# EAGLE design KOTLETA (EAGLE 9.3.0)
Assembly variants: basic

## Sheet 1 of 2: page1
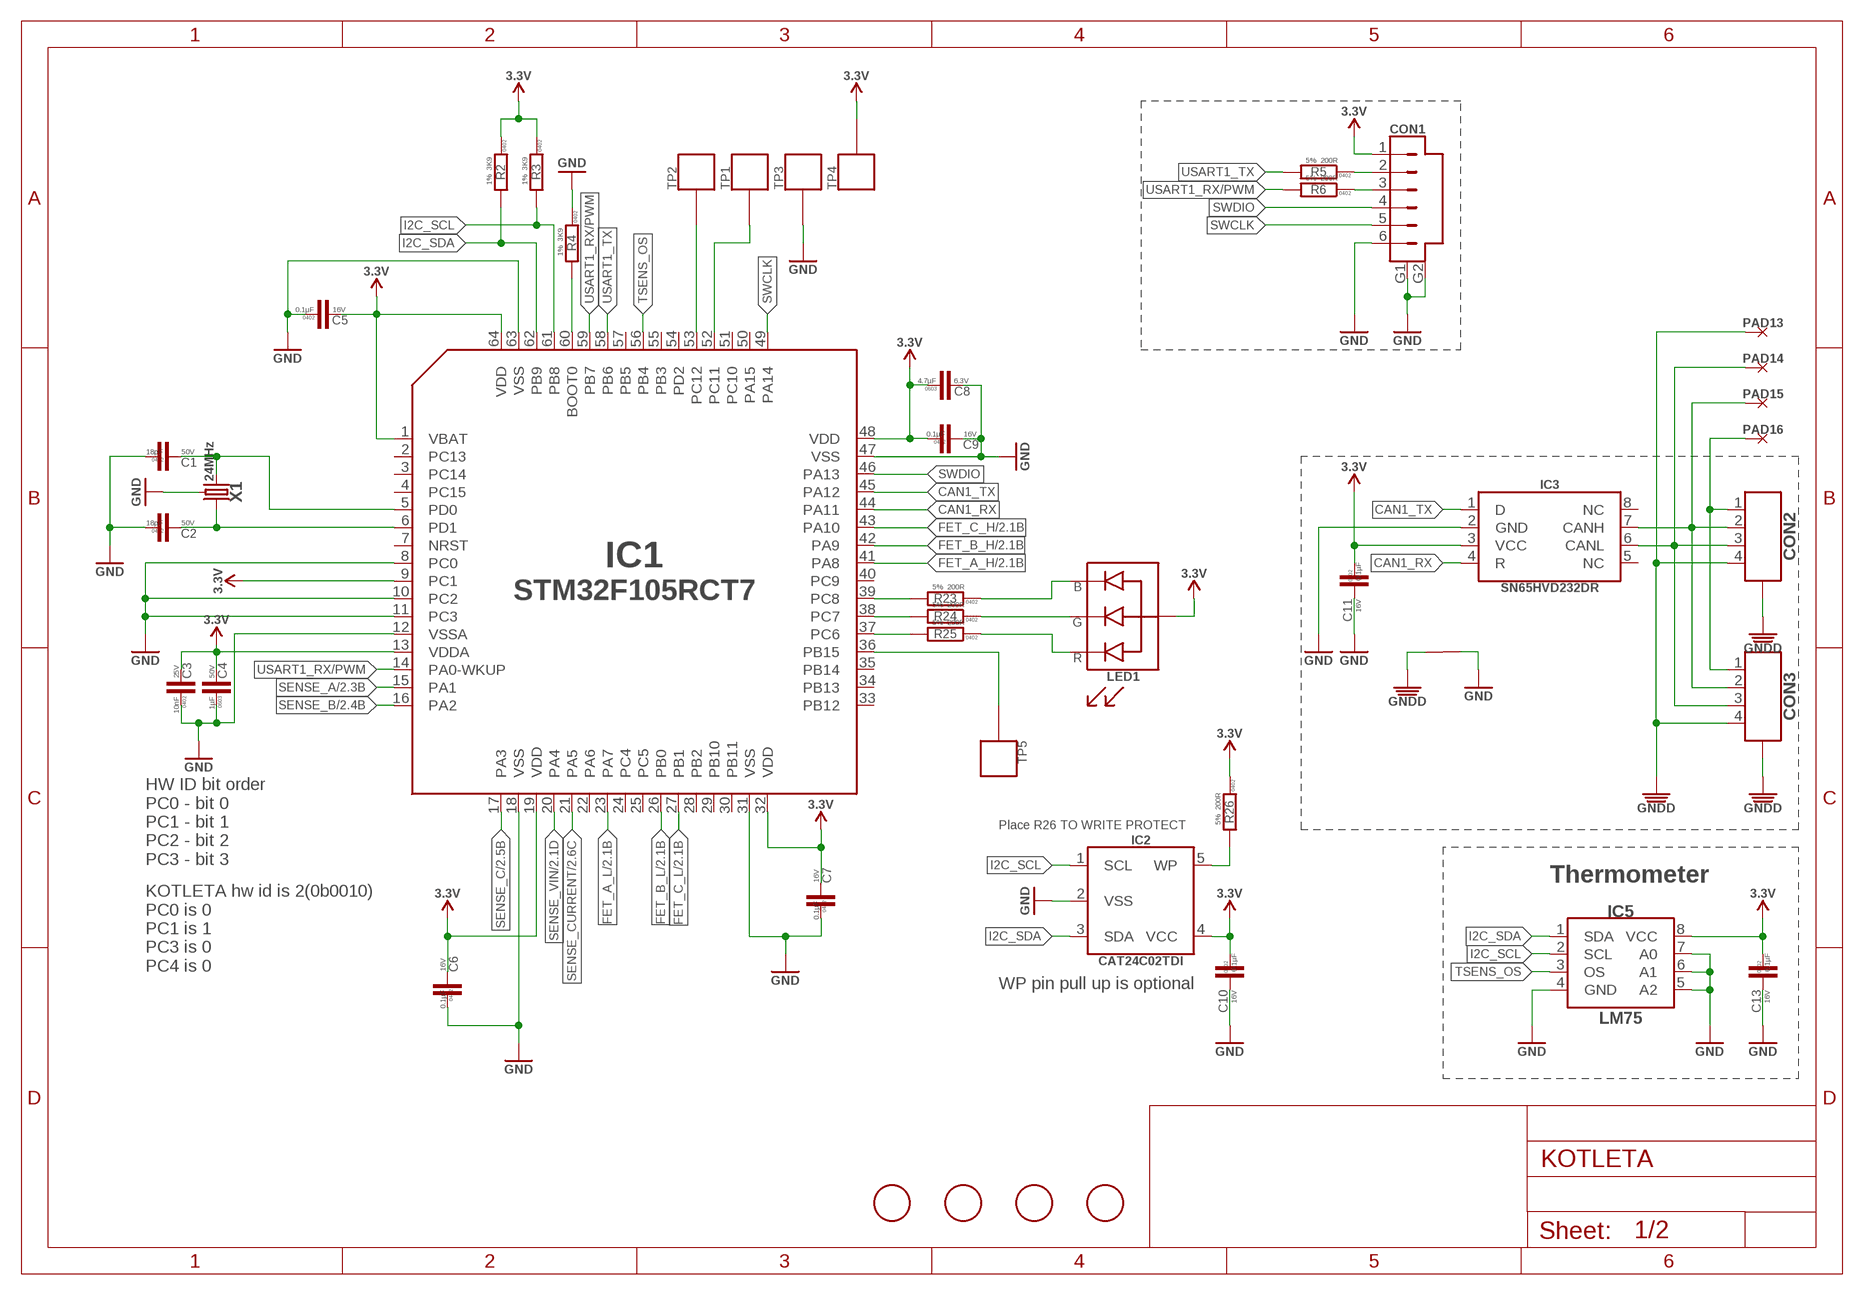
[diagram p0: schematic, sheet 1]

### Parts
C1  18pF  18PF-50V_5%_NP0-0402  [C0402]
C2  18pF  18PF-50V_5%_NP0-0402  [C0402]
C3  10nF  10NF-25V_10%_X7R-0402  [C0402]
C4  1µF  1µF-50V_10%_X7R-0603  [C0603]
C5  0.1µF  0.1µF-16V_10%_X7R-0402  [C0402]
C6  0.1µF  0.1µF-16V_10%_X7R-0402  [C0402]
C7  0.1µF  0.1µF-16V_10%_X7R-0402  [C0402]
C8  4.7µF  4.7µF-6.3V_10%_X7R-0603  [C0603]
C9  0.1µF  0.1µF-16V_10%_X7R-0402  [C0402]
C10  0.1µF  0.1µF-16V_10%_X7R-0402  [C0402]
C11  0.1µF  0.1µF-16V_10%_X7R-0402  [C0402]
C13  0.1µF  0.1µF-16V_10%_X7R-0402  [C0402]
CON1  CON-6P  [SM06B]
CON2  CON-4P-JST_GH-RA  [JST_GH-4P-RA]
CON3  CON-4P-JST_GH-RA  [JST_GH-4P-RA]
FD1  FIDUCIALMOUNT  [FIDUCIA-MOUNT]  (not fitted in variant basic)
FD2  FIDUCIALMOUNT  [FIDUCIA-MOUNT]  (not fitted in variant basic)
FD3  FIDUCIALMOUNT  [FIDUCIA-MOUNT]  (not fitted in variant basic)
FD4  FIDUCIALMOUNT  [FIDUCIA-MOUNT]  (not fitted in variant basic)
IC1  STM32F105RCT6  [TQFP64]
IC2  CAT24C02  [SOT23-5L]
IC3  SN65HVD232D  [SOIC8]
IC5  LM75BD-TSSOP8  [TSSOP8]
LED1  LTST-C19HE1WT  [LITE_ON_RGB_LED]
PAD13  PAD-HOLE-0.6  [HOLE_0.6]  (not fitted in variant basic)
PAD14  PAD-HOLE-0.6  [HOLE_0.6]  (not fitted in variant basic)
PAD15  PAD-HOLE-0.6  [HOLE_0.6]  (not fitted in variant basic)
PAD16  PAD-HOLE-0.6  [HOLE_0.6]  (not fitted in variant basic)
R2  3K9  3K9-1%-0402  [R0402]
R3  3K9  3K9-1%-0402  [R0402]
R4  3K9  3K9-1%-0402  [R0402]
R5  200R  200R-5%-0402  [R0402]
R6  200R  200R-5%-0402  [R0402]
R23  200R  200R-5%-0402  [R0402]
R24  200R  200R-5%-0402  [R0402]
R25  200R  200R-5%-0402  [R0402]
R26  200R  200R-5%-0402  [R0402]  (not fitted in variant basic)
TP1  PAD.05  [PAD.05X.05]  (not fitted in variant basic)
TP2  PAD.05  [PAD.05X.05]  (not fitted in variant basic)
TP3  PAD.05  [PAD.05X.05]  (not fitted in variant basic)
TP4  PAD.05  [PAD.05X.05]  (not fitted in variant basic)
TP5  PAD.05  [PAD.05X.05]  (not fitted in variant basic)
U$2  CONNECTION  [CONNECTION]  (not fitted in variant basic)
X1  24MHz  CRYSTAL-4P-24MHZ-3.2X2.5-4P  [OSCILLATOR-3.2X2.5-4P]

### Nets
BOOT0: IC1.60(BOOT0) R4.2
CAN1_RX: IC1.44(PA11) IC3.4(R)
CAN1_TX: IC1.45(PA12) IC3.1(D)
FET_A_H: IC1.41(PA8) ; also sheet 2
FET_A_L: IC1.23(PA7) ; also sheet 2
FET_B_H: IC1.42(PA9) ; also sheet 2
FET_B_L: IC1.26(PB0) ; also sheet 2
FET_C_H: IC1.43(PA10) ; also sheet 2
FET_C_L: IC1.27(PB1) ; also sheet 2
GND: C1.1 C2.1 C3.1 C4.P$1 C5.1 C6.1 C7.1 C8.P$2 C9.2 C10.2 C11.2 C13.2 CON1.6 CON1.G1 CON1.G2 IC1.8(PC0) IC1.10(PC2) IC1.11(PC3) IC1.12(VSSA) IC1.18(VSS) IC1.31(VSS) IC1.47(VSS) IC1.63(VSS) IC2.2(VSS) IC3.2(GND) IC5.4(GND) IC5.5(A2) IC5.6(A1) IC5.7(A0) R4.1 TP3.P$1 U$2.P$2 X1.2(GND) X1.4(GND) ; also sheet 2
GNDD: CON2.4 CON2.M$0(GND) CON2.M$1(GND) CON3.4 CON3.M$0(GND) CON3.M$1(GND) PAD13.P$1 U$2.P$1
I2C_SCL: IC1.61(PB8) IC2.1(SCL) IC5.2(SCL) R3.2
I2C_SDA: IC1.62(PB9) IC2.3(SDA) IC5.1(SDA) R2.2
N$1: CON1.2 R5.1
N$2: CON1.3 R6.1
N$3: IC1.37(PC6) R25.2
N$6: LED1.B R23.1
N$7: LED1.R R25.1
N$10: IC2.5(WP) R26.2
N$12: IC1.38(PC7) R24.2
N$16: C1.2 IC1.5(PD0) X1.3
N$18: IC1.39(PC8) R23.2
N$21: C2.2 IC1.6(PD1) X1.1
N$22: CON2.1 CON3.1 PAD16.P$1
N$23: CON2.2 CON3.2 IC3.7(CANH) PAD15.P$1
N$25: CON2.3 CON3.3 IC3.6(CANL) PAD14.P$1
N$26: LED1.G R24.1
N$27: IC1.53(PC12) TP2.P$1
N$28: IC1.36(PB15) TP5.P$1
N$29: IC1.52(PC11) TP1.P$1
SENSE_A: IC1.15(PA1) ; also sheet 2
SENSE_B: IC1.16(PA2) ; also sheet 2
SENSE_C: IC1.17(PA3) ; also sheet 2
SENSE_CURRENT: IC1.21(PA5) ; also sheet 2
SENSE_VIN: IC1.20(PA4) ; also sheet 2
SWCLK: CON1.5 IC1.49(PA14)
SWDIO: CON1.4 IC1.46(PA13)
TSENS_OS: IC1.56(PB4) IC5.3(OS)
USART1_RX/PWM: IC1.14(PA0-WKUP) IC1.59(PB7) R6.2
USART1_TX: IC1.58(PB6) R5.2
VDD_3V3: C3.2 C4.P$2 C5.2 C6.2 C7.2 C8.P$1 C9.1 C10.1 C11.1 C13.1 CON1.1 IC1.1(VBAT) IC1.9(PC1) IC1.13(VDDA) IC1.19(VDD) IC1.32(VDD) IC1.48(VDD) IC1.64(VDD) IC2.4(VCC) IC3.3(VCC) IC5.8(VCC) LED1.+(A) R2.1 R3.1 R26.1 TP4.P$1 ; supply symbol labelled 3.3V ; also sheet 2
Unconnected: IC1.2(PC13) IC1.3(PC14) IC1.4(PC15) IC1.7(NRST) IC1.22(PA6) IC1.24(PC4) IC1.25(PC5) IC1.28(PB2) IC1.29(PB10) IC1.30(PB11) IC1.33(PB12) IC1.34(PB13) IC1.35(PB14) IC1.40(PC9) IC1.50(PA15) IC1.51(PC10) IC1.54(PD2) IC1.55(PB3) IC1.57(PB5) IC3.5(NC) IC3.8(NC)

### Notes on the sheet
- Place R26 TO WRITE PROTECT
- HW ID bit order
  PC0 - bit 0
  PC1 - bit 1
  PC2 - bit 2
  PC3 - bit 3
- Thermometer
- KOTLETA hw id is 2(0b0010)
  PC0 is 0
  PC1 is 1
  PC3 is 0
  PC4 is 0
- WP pin pull up is optional

## Sheet 2 of 2
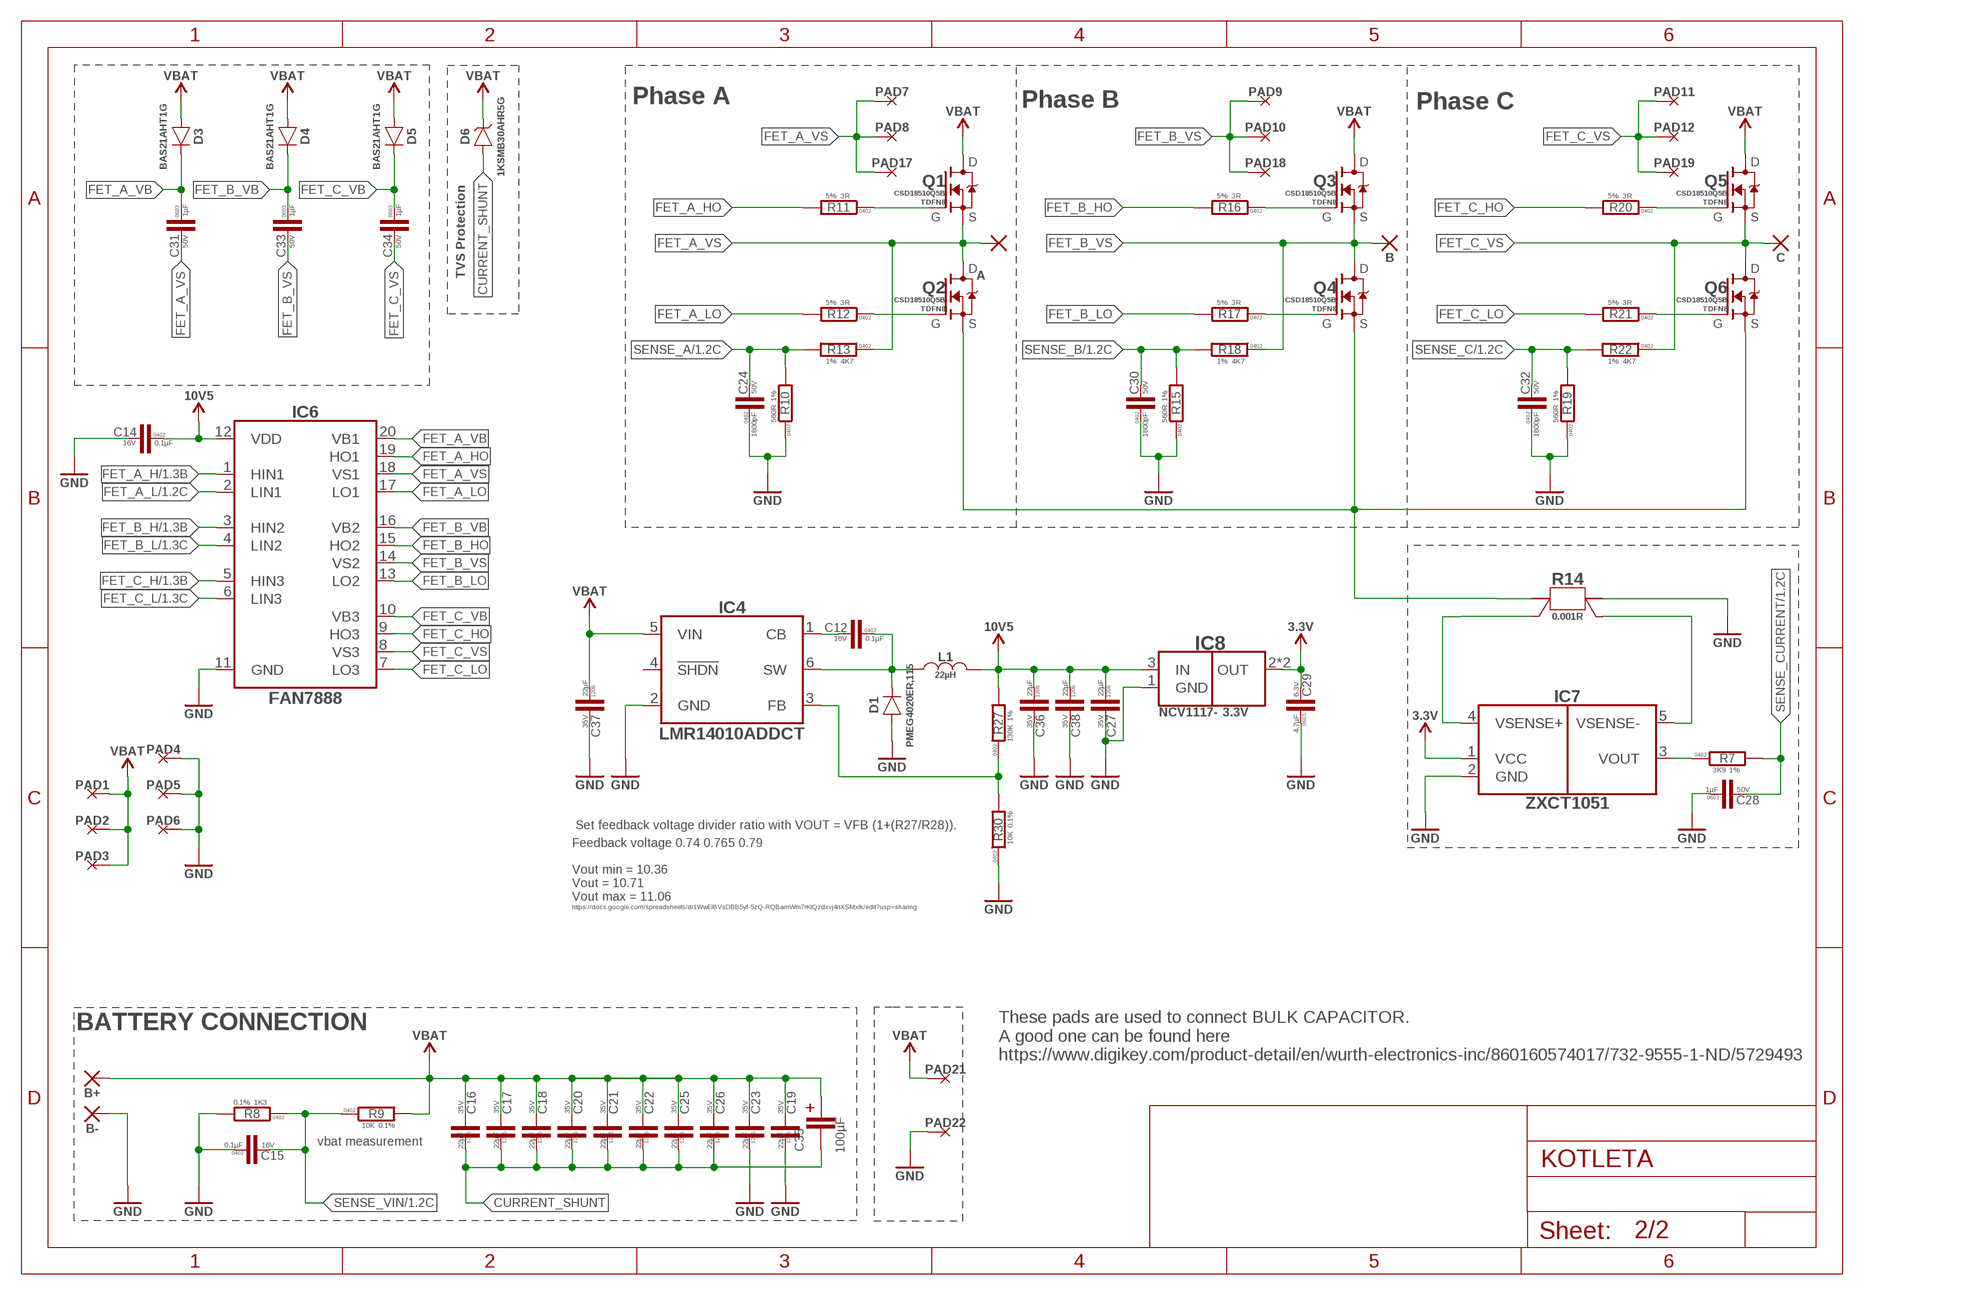
[diagram p1: schematic, sheet 2]

### Parts
A  WIREPADSMD5-2,5  [5-2,5]  (not fitted in variant basic)
B  WIREPADSMD5-2,5  [5-2,5]  (not fitted in variant basic)
B+  WIREPADSMD5-2,5  [5-2,5]  (not fitted in variant basic)
B-  WIREPADSMD5-2,5  [5-2,5]  (not fitted in variant basic)
C  WIREPADSMD5-2,5  [5-2,5]  (not fitted in variant basic)
C12  0.1µF  0.1µF-16V_10%_X7R-0402  [C0402]
C14  0.1µF  0.1µF-16V_10%_X7R-0402  [C0402]
C15  0.1µF  0.1µF-16V_10%_X7R-0402  [C0402]
C16  22µF  22µF-35V_20%_X5R-1206  [C1206]
C17  22µF  22µF-35V_20%_X5R-1206  [C1206]
C18  22µF  22µF-35V_20%_X5R-1206  [C1206]
C19  22µF  22µF-35V_20%_X5R-1206  [C1206]
C20  22µF  22µF-35V_20%_X5R-1206  [C1206]
C21  22µF  22µF-35V_20%_X5R-1206  [C1206]
C22  22µF  22µF-35V_20%_X5R-1206  [C1206]
C23  22µF  22µF-35V_20%_X5R-1206  [C1206]
C24  1800pF  1800PF-50V_10%_X7R-0402  [C0402]
C25  22µF  22µF-35V_20%_X5R-1206  [C1206]
C26  22µF  22µF-35V_20%_X5R-1206  [C1206]
C27  22µF  22µF-35V_20%_X5R-1206  [C1206]
C28  1µF  1µF-50V_10%_X7R-0603  [C0603]
C29  4.7µF  4.7µF-6.3V_10%_X7R-0603  [C0603]
C30  1800pF  1800PF-50V_10%_X7R-0402  [C0402]
C31  1µF  1µF-50V_10%_X7R-0603  [C0603]
C32  1800pF  1800PF-50V_10%_X7R-0402  [C0402]
C33  1µF  1µF-50V_10%_X7R-0603  [C0603]
C34  1µF  1µF-50V_10%_X7R-0603  [C0603]
C35  100µF  C-TANT-3024  [3024]
C36  22µF  22µF-35V_20%_X5R-1206  [C1206]
C37  22µF  22µF-35V_20%_X5R-1206  [C1206]
C38  22µF  22µF-35V_20%_X5R-1206  [C1206]
D1  PMEG4020  [SOD123W]
D3  BAS21AHT1G  [SOD323]
D4  BAS21AHT1G  [SOD323]
D5  BAS21AHT1G  [SOD323]
D6  1KSMB30AHR5G  [DO-214AA(SMB)]
IC4  LMR14010ADDCT  [SOT23-6]
IC6  FAN7888  [SOIC20]
IC7  ZXCT1051  [SOT23-5L]
IC8  3.3V  NCV1117-3.3  [SOT-223]
L1  22µH  22µH-22U-SRN5040  [SRN5040]
PAD1  PAD-HOLE-0.6  [HOLE_0.6]  (not fitted in variant basic)
PAD2  PAD-HOLE-0.6  [HOLE_0.6]  (not fitted in variant basic)
PAD3  PAD-HOLE-0.6  [HOLE_0.6]  (not fitted in variant basic)
PAD4  PAD-HOLE-0.6  [HOLE_0.6]  (not fitted in variant basic)
PAD5  PAD-HOLE-0.6  [HOLE_0.6]  (not fitted in variant basic)
PAD6  PAD-HOLE-0.6  [HOLE_0.6]  (not fitted in variant basic)
PAD7  PAD-HOLE-0.6  [HOLE_0.6]  (not fitted in variant basic)
PAD8  PAD-HOLE-0.6  [HOLE_0.6]  (not fitted in variant basic)
PAD9  PAD-HOLE-0.6  [HOLE_0.6]  (not fitted in variant basic)
PAD10  PAD-HOLE-0.6  [HOLE_0.6]  (not fitted in variant basic)
PAD11  PAD-HOLE-0.6  [HOLE_0.6]  (not fitted in variant basic)
PAD12  PAD-HOLE-0.6  [HOLE_0.6]  (not fitted in variant basic)
PAD17  PAD-HOLE-0.6  [HOLE_0.6]  (not fitted in variant basic)
PAD18  PAD-HOLE-0.6  [HOLE_0.6]  (not fitted in variant basic)
PAD19  PAD-HOLE-0.6  [HOLE_0.6]  (not fitted in variant basic)
PAD21  PAD-HOLE-0.8  [HOLE_0.8]
PAD22  PAD-HOLE-0.8  [HOLE_0.8]
Q1  CSD18510Q5B  [PG-TDSON-8]
Q2  CSD18510Q5B  [PG-TDSON-8]
Q3  CSD18510Q5B  [PG-TDSON-8]
Q4  CSD18510Q5B  [PG-TDSON-8]
Q5  CSD18510Q5B  [PG-TDSON-8]
Q6  CSD18510Q5B  [PG-TDSON-8]
R7  3K9  3K9-1%-0402  [R0402]
R8  1K3  1K3-0.1%-0402  [R0402]
R9  10K  10K-0.1%-0402  [R0402]
R10  560R  560R-1%-0402  [R0402]
R11  3R  3R-5%-0402  [R0402]
R12  3R  3R-5%-0402  [R0402]
R13  4K7  4K7-1%-0402  [R0402]
R14  0.001R  CURRENT_SHUNT_KELVIN-0.001R-2010-KELVIN  [R2010-KELVIN]
R15  560R  560R-1%-0402  [R0402]
R16  3R  3R-5%-0402  [R0402]
R17  3R  3R-5%-0402  [R0402]
R18  4K7  4K7-1%-0402  [R0402]
R19  560R  560R-1%-0402  [R0402]
R20  3R  3R-5%-0402  [R0402]
R21  3R  3R-5%-0402  [R0402]
R22  4K7  4K7-1%-0402  [R0402]
R27  130K  R-1%-0402  [R0402]
R30  10K  10K-0.1%-0402  [R0402]

### Nets
BLABLA: IC7.3(VOUT) R7.1
CURRENT_SHUNT: C16.P$1 C17.P$1 C18.P$1 C20.P$1 C21.P$1 C22.P$1 C25.P$1 C26.P$1 C35.- D6.A Q2.1S(S) Q2.2S(S) Q2.3S(S) Q4.1S(S) Q4.2S(S) Q4.3S(S) Q6.1S(S) Q6.2S(S) Q6.3S(S) R14.1 R14.11
FET_A_H: IC6.1(HIN1) ; also sheet 1
FET_A_HO: IC6.19(HO1) R11.2
FET_A_L: IC6.2(LIN1) ; also sheet 1
FET_A_LO: IC6.17(LO1) R12.2
FET_A_VB: C31.P$1 D3.C IC6.20(VB1)
FET_A_VS: A.1(P) C31.P$2 IC6.18(VS1) PAD7.P$1 PAD8.P$1 PAD17.P$1 Q1.1S(S) Q1.2S(S) Q1.3S(S) Q2.5D(D) Q2.6D(D) Q2.7D(D) Q2.8D(D) Q2.PAD_D(D) R13.1
FET_B_H: IC6.3(HIN2) ; also sheet 1
FET_B_HO: IC6.15(HO2) R16.2
FET_B_L: IC6.4(LIN2) ; also sheet 1
FET_B_LO: IC6.13(LO2) R17.2
FET_B_VB: C33.P$1 D4.C IC6.16(VB2)
FET_B_VS: B.1(P) C33.P$2 IC6.14(VS2) PAD9.P$1 PAD10.P$1 PAD18.P$1 Q3.1S(S) Q3.2S(S) Q3.3S(S) Q4.5D(D) Q4.6D(D) Q4.7D(D) Q4.8D(D) Q4.PAD_D(D) R18.1
FET_C_H: IC6.5(HIN3) ; also sheet 1
FET_C_HO: IC6.9(HO3) R20.2
FET_C_L: IC6.6(LIN3) ; also sheet 1
FET_C_LO: IC6.7(LO3) R21.2
FET_C_VB: C34.P$1 D5.C IC6.10(VB3)
FET_C_VS: C34.P$2 C.1(P) IC6.8(VS3) PAD11.P$1 PAD12.P$1 PAD19.P$1 Q5.1S(S) Q5.2S(S) Q5.3S(S) Q6.5D(D) Q6.6D(D) Q6.7D(D) Q6.8D(D) Q6.PAD_D(D) R22.1
GND: B-.1(P) C14.2 C15.1 C19.P$1 C23.P$1 C24.1 C27.P$2 C28.P$1 C29.P$1 C30.1 C32.1 C36.P$2 C37.P$2 C38.P$2 D1.A IC4.2(GND) IC6.11(GND) IC7.2(GND) IC8.1(GND) PAD4.P$1 PAD5.P$1 PAD6.P$1 PAD22.P$1 R8.2 R10.1 R14.2 R14.22 R15.1 R19.1 R30.1 ; also sheet 1
N$4: Q2.4G(G) R12.1
N$5: Q3.4G(G) R16.1
N$8: Q4.4G(G) R17.1
N$11: Q5.4G(G) R20.1
N$13: IC7.5(VSENSE-) R14.S2
N$14: Q1.4G(G) R11.1
N$17: Q6.4G(G) R21.1
N$19: C12.1 D1.C IC4.6(SW) L1.P$1
N$20: IC7.4(VSENSE+) R14.S1
N$24: IC4.3(FB) R27.1 R30.2
N$31: C12.2 IC4.1(CB)
SENSE_A: C24.2 R10.2 R13.2 ; also sheet 1
SENSE_B: C30.2 R15.2 R18.2 ; also sheet 1
SENSE_C: C32.2 R19.2 R22.2 ; also sheet 1
SENSE_CURRENT: C28.P$2 R7.2 ; also sheet 1
SENSE_VIN: C15.2 R8.1 R9.1 ; also sheet 1
VBAT: B+.1(P) C16.P$2 C17.P$2 C18.P$2 C19.P$2 C20.P$2 C21.P$2 C22.P$2 C23.P$2 C25.P$2 C26.P$2 C35.+ C37.P$1 D3.A D4.A D5.A D6.C IC4.5(VIN) PAD1.P$1 PAD2.P$1 PAD3.P$1 PAD21.P$1 Q1.5D(D) Q1.6D(D) Q1.7D(D) Q1.8D(D) Q1.PAD_D(D) Q3.5D(D) Q3.6D(D) Q3.7D(D) Q3.8D(D) Q3.PAD_D(D) Q5.5D(D) Q5.6D(D) Q5.7D(D) Q5.8D(D) Q5.PAD_D(D) R9.2
VDD_3V3: C29.P$2 IC7.1(VCC) IC8.2(OUT) IC8.4(OUT) ; supply symbol labelled 3.3V ; also sheet 1
VDD_10V5: C14.1 C27.P$1 C36.P$1 C38.P$1 IC6.12(VDD) IC8.3(IN) L1.P$2 R27.2 ; supply symbol labelled 10V5
Unconnected: IC4.4(!SHDN)

### Notes on the sheet
- Phase A | Phase B | Phase C
- TVS Protection
- Set feedback voltage divider ratio with VOUT = VFB (1+(R27/R28)).
- Feedback voltage 0.74 0.765 0.79
- Vout min = 10.36
  Vout = 10.71
  Vout max = 11.06
- https://docs.google.com/spreadsheets/d/1WwElBVsDBB5yf-5zQ-RQBamWm7rKtQzdxvj4nXSMxlk/edit?usp=sharing
- BATTERY CONNECTION
- These pads are used to connect BULK CAPACITOR.
  A good one can be found here
  https://www.digikey.com/product-detail/en/wurth-electronics-inc/860160574017/732-9555-1-ND/5729493
- vbat measurement

## Library data of the parts
A B B+ B- C = valenok_master_library:WIREPAD: Wire PAD connect wire on PCB
C1 C2 = C_digikey:18PF; DIGIKEY#: 399-8828-1-ND; MANF: Kemet; MANF#: CBR04C180F5GAC; OPERATING_TEMP: -55°C ~ 125°C; PACKAGE: 0402; TC: C0G, NP0; TOLERANCE: +-1%; VOLTAGE: 50V
C3 = C_digikey:10NF; DIGIKEY#: 490-1312-1-ND; MANF: Murata Electronics North America; MANF#: GRM155R71E103KA01D; OPERATING_TEMP: -55°C ~ 125°C; PACKAGE: 0402; TC: X7R; TOLERANCE: +-10%; VOLTAGE: 25V
C4 C28 C31 C33 C34 = C_digikey:1µF; DIGIKEY#: 587-3247-1-ND; MANF: Taiyo Yuden; MANF#: UMK107AB7105KA-T; OPERATING_TEMP: -55°C ~ 125°C; PACKAGE: 0603; TC: X7R; TOLERANCE: +-10%; VOLTAGE: 50V
C5-C7 C9-C15 = C_digikey:0.1µF; DIGIKEY#: 490-3261-1-ND; MANF: Murata Electronics North America; MANF#: GRM155R71C104KA88D; OPERATING_TEMP: -55°C ~ 125°C; PACKAGE: 0402; TC: X7R; TOLERANCE: +-10%; VOLTAGE: 16V
C8 C29 = C_digikey:4.7µF; DIGIKEY#: 1276-2087-1-ND; MANF: Samsung Electro-Mechanics America; MANF#: CL10B475KQ8NQNC; OPERATING_TEMP: -55°C ~ 125°C; PACKAGE: 0603; TC: X7R; TOLERANCE: +-10%; VOLTAGE: 6.3V
C16-C23 C25-C27 C36-C38 = C_digikey:22µF; DIGIKEY#: 445-8045-6-ND; MANF: TDK Corporation; MANF#: C3216X5R1V226M160AC; OPERATING_TEMP: -55°C ~ 85°C; PACKAGE: 1206; TC: X5R; TOLERANCE: +-20%; VOLTAGE: 35V
C24 C30 C32 = C_digikey:1800PF; DIGIKEY#: 311-1721-1-ND; MANF: Yageo; MANF#: CC0402KRX7R9BB182; OPERATING_TEMP: -55°C ~ 125°C; PACKAGE: 0402; TC: X7R; TOLERANCE: ±10%; VOLTAGE: 50V
C35 = sapog_reference_hardware:C-TANT: Tantalum capacitor; DIGIKEY#: 718-1942-1-ND; MANF: Vishay Sprague; MANF#: 597D107X0035F2T; OPERATING_TEMPERATURE: -55°C ~ 125°C; VOLTAGE: 35V
CON1 = Connectors:CON-6P: CONN HEADER SH 6POS SIDE 1MM TIN; DIGIKEY#: 455-1806-1-ND; MANF: JST Sales America Inc; MANF#: SM06B-SRSS-TB(LF)(SN); PARTNO: SM06B-SRSS-TB
CON2 CON3 = Connectors:CON-4P: Connector Receptacle 4 Position 0.049" (1.25mm) Tin Surface Mount; DIGIKEY#: 455-1566-1-ND; MANF: JST Sales America Inc; MANF#: SM04B-GHS-TB(LF)(SN)
D1 = Diodes:PMEG4020: DIODE SCHOTTKY 40V 2A SOD123W; DIGIKEY#: 1727-5385-2-ND; IF: 2A; MANF: NXP Semiconductors; MANF#: PMEG4020ER,115; VOLTAGE: 40V
D3-D5 = Diodes:BAS21AHT1G: Diode Standard 250V 200mA (DC) Surface Mount SOD-323; DIGIKEY#: BAS21AHT1GOSCT-ND; MANF: ON Semiconductor; MANF#: BAS21AHT1G
D6 = TVS_diodes:1KSMB30AHR5G: TVS DIODE 25.6V 41.4V DO214AA; DIGIKEY#: 1KSMB30AHR5GTR-ND; MANF: Taiwan Semiconductor Corporation; MANF#: 1KSMB30AHR5G
FD1-FD4 = sapog_reference_hardware:FIDUCIALMOUNT
IC1 = stm32:STM32F105RCT6: ARM® Cortex®-M3 STM32F1 Microcontroller IC 32-Bit 72MHz 256KB (256K x 8) FLASH; DIGIKEY#: 497-11547-ND; MANF: STMicroelectronics; MANF#: STM32F105RCT7; OPERATING_TEMP: -40°C ~ 105°C (TA)
IC2 = misc:CAT24C02: IC EEPROM 2KBIT 400KHZ TSOT23-5; DIGIKEY#: CAT24C02TDI-GT3AOSCT-ND; MANF: ON Semiconductor; MANF#: CAT24C02TDI-GT3A
IC3 = serial_interfaces:SN65HVD232D: IC CAN TRANSCEIVER 3.3V 8-SOIC; DIGIKEY#: 296-26344-1-ND; MANF: Texas Instruments; MANF#: SN65HVD232DR
IC4 = dc-dc:LMR14010ADDCT: Buck Switching Regulator IC Positive Adjustable 0.765V 1 Output 1A SOT-23-6 Thin, TSOT-23-6 Datasheet <http://www.ti.com/lit/ds/symlink/lmr14010a.pdf>; DIGIKEY#: 296-49072-2-ND; MANF: Texas Instruments; MANF#: LMR14010ADDCT
IC5 = misc:LM75BD: SENSOR TEMPERATURE I2C 8TSSOP; DIGIKEY#: 568-4768-1-ND; MANF: NXP Semiconductors; MANF#: LM75BDP,118
IC6 = mosfet_drivers:FAN7888: IC GATE DRIVER HALF BRIDG 20SOIC; DIGIKEY#: FAN7888MXTR-ND; MANF: Fairchild Semiconductor; MANF#: FAN7888MX; PARTNO: FAN7888MX
IC7 = misc:ZXCT1051: IC CURRENT MONITOR 1% SOT23-5; DIGIKEY#: ZXCT1051E5CT-ND; MANF: Diodes Incorporated; MANF#: ZXCT1051E5TA
IC8 = linear regulators:NCV1117-3.3: IC REG LDO 3.3V 1A SOT223; DIGIKEY#: NCV1117ST33T3GOSCT-ND; MANF: ON Semiconductor; MANF#: NCV1117ST33T3G
L1 = power_inductors:22µH: Wirewound Inductor; DIGIKEY#: SRN5040-220MCT-ND; MANF: Bourns Inc; MANF#: SRN5040-220M
LED1 = myxa_masterlib:LTST-C19HE1WT; DIGIKEY#: 160-2162-1-ND; MANF: Lite-On Inc; MANF#: LTST-C19HE1WT
PAD1-PAD19 PAD21 PAD22 = PADS:PAD
Q1-Q6 = mosfet:CSD18510Q5B: N-Channel 40V 300A (Tc) 156W (Tc) Surface Mount 8-VSON-CLIP (5x6); DIGIKEY#: 296-48514-2-ND; MANF: Texas Instruments; MANF#: CSD18510Q5B; PACKAGE: TDFN8
R2-R4 R7 = R_digikey:3K9; DIGIKEY#: 311-3.90KLRCT-ND; MANF: Yageo; MANF#: RC0402FR-073K9L; PACKAGE: 0402; TOLERANCE: 1%
R5 R6 R23-R26 = R_digikey:200R; DIGIKEY#: 311-200JRCT-ND; MANF: Yageo; MANF#: RC0402JR-07200RL; PACKAGE: 0402; PARTNO: RC0402FR-07240RL; TOLERANCE: 5%
R8 = R_digikey:1K3; DIGIKEY#: P1.3KDCCT-ND; MANF: Panasonic Electronic Components; MANF#: ERA-2AEB132X; PACKAGE: 0402; TOLERANCE: 0.1%
R9 R30 = R_digikey:10K; DIGIKEY#: P10KDCCT-ND; MANF: Panasonic Electronic Components; MANF#: ERA-2AEB103X; PACKAGE: 0402; TOLERANCE: 0.1%
R10 R15 R19 = R_digikey:560R; DIGIKEY#: 541-560LCT-ND; MANF: Vishay Dale; MANF#: CRCW0402560RFKED; PACKAGE: 0402; TOLERANCE: 1%
R11 R12 R16 R17 R20 R21 = R_digikey:3R; DIGIKEY#: P3.0JCT-ND; MANF: Panasonic Electronic Components; MANF#: ERJ-2GEJ3R0X; PACKAGE: 0402; TOLERANCE: 5%
R13 R18 R22 = R_digikey:4K7; DIGIKEY#: 311-4.7KLRCT-ND; MANF: Yageo; MANF#: RC0402FR-074K7L; PACKAGE: 0402; TOLERANCE: 1%
R14 = SHUNT_RESISTORS:CURRENT_SHUNT_KELVIN; DIGIKEY#: CSNL2010FT1L00TR-ND; MANF: Stackpole Electronics Inc.; MANF#: CSNL2010FT1L00; POWER: 1.5W; TC: ±50ppm/°C; TOLERANCE: 1%
R27 = rc:R; DIGIKEY#: YAG2969CT-ND; MANF: Yageo; MANF#: RC0402FR-07130KL; PACKAGE: 0402; TOLERANCE: 1%
TP1-TP5 = pixhawk2:PAD: Test pad This footprint includes three classes: The actual test pads, a pogo-pin footprint to mount the pogo-pin as through-hole part and a hole footprint which allows the head of the pogo-pin to pass through (do NOT use the hole to mount the pogo-pin). In a typical test setup, the stack would consist of three PCBs: The actual PCB under testing with a test pad on the bottom, then a second PCB with the hole for the pogo-pin head where the PCB under testing is pressed on and a third PCB at 30 mm / 1.2" distance with the pogo-pin footprints. The pogo-pins are soldered to the last PCB. To create the stack, copy the board under testing and exchange the footprints - this way the correct positioning is ensured.; BOM: EXCLUDE; PARTNO: *
U$2 = GNSS2_master_lib:CONNECTION; BOM: EXCLUDE
X1 = crystal:CRYSTAL-4P: Smd Crystal 18pF; DIGIKEY#: 1253-1198-1-ND; MANF: Kyocera International Inc. Electronic Components; MANF#: CX3225GB24000P0HPQCC

## Net classes
1 power: width 0.15 mm, drill 0.2 mm, clearance 0.152 mm

## Board
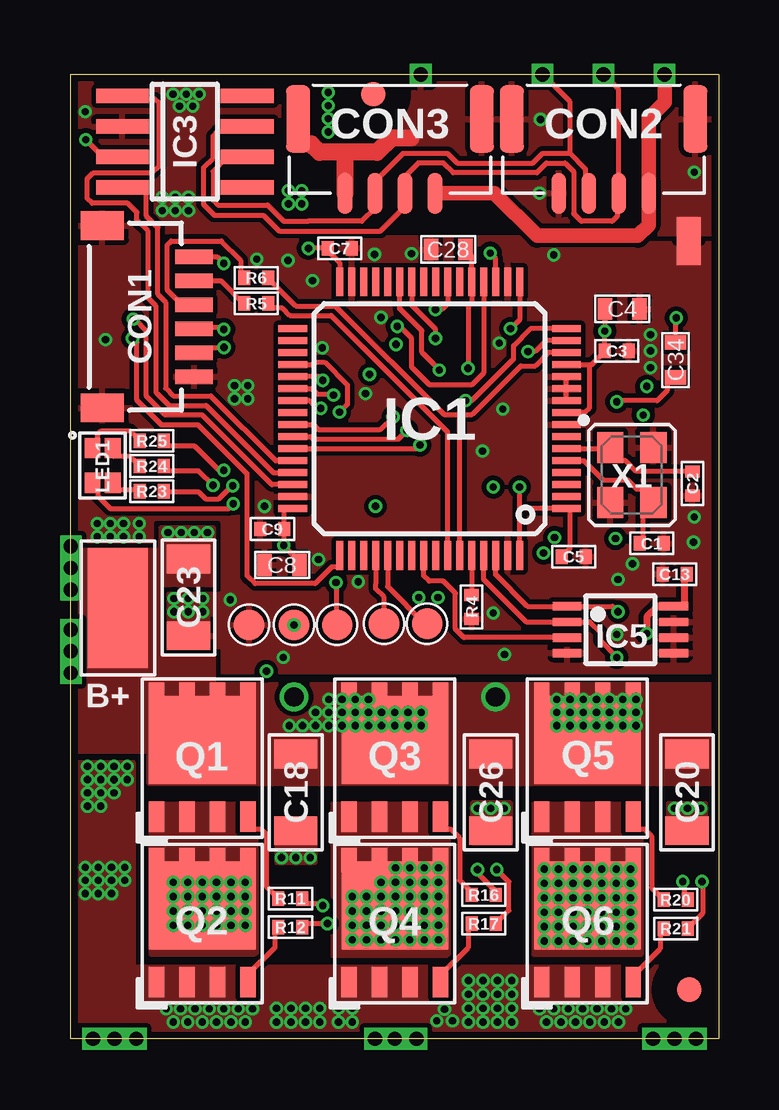
[diagram p2: board, top side]
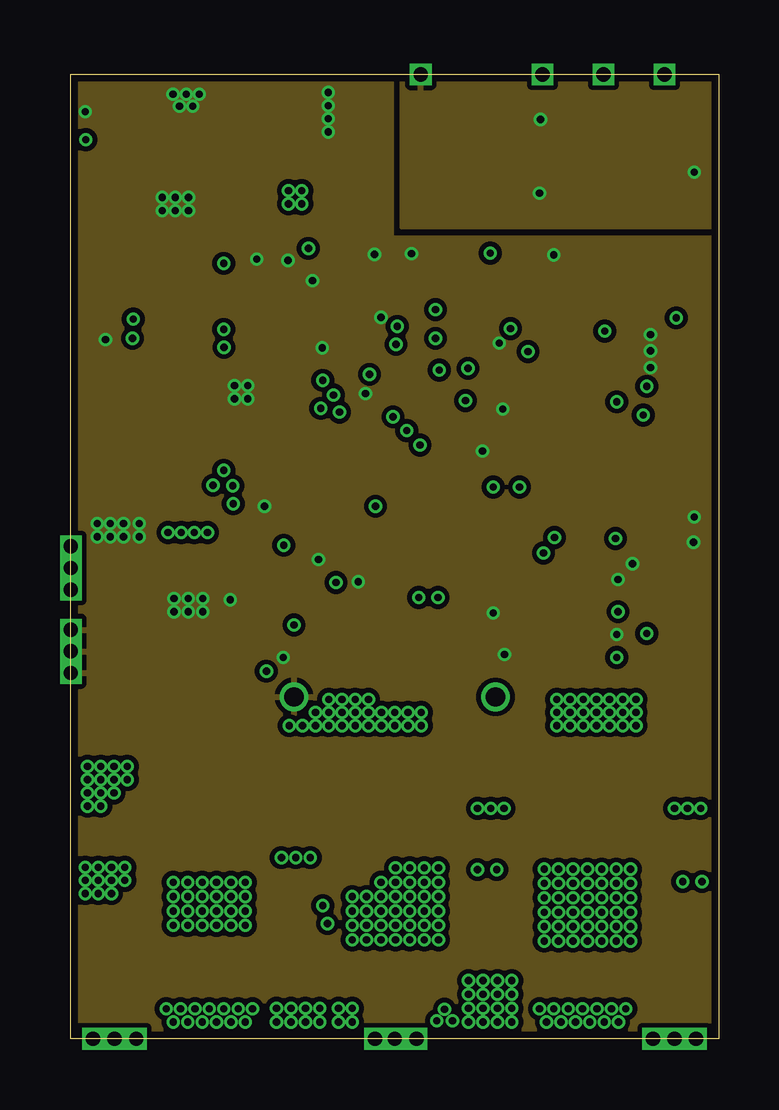
[diagram p3: board, inner layer gnd]
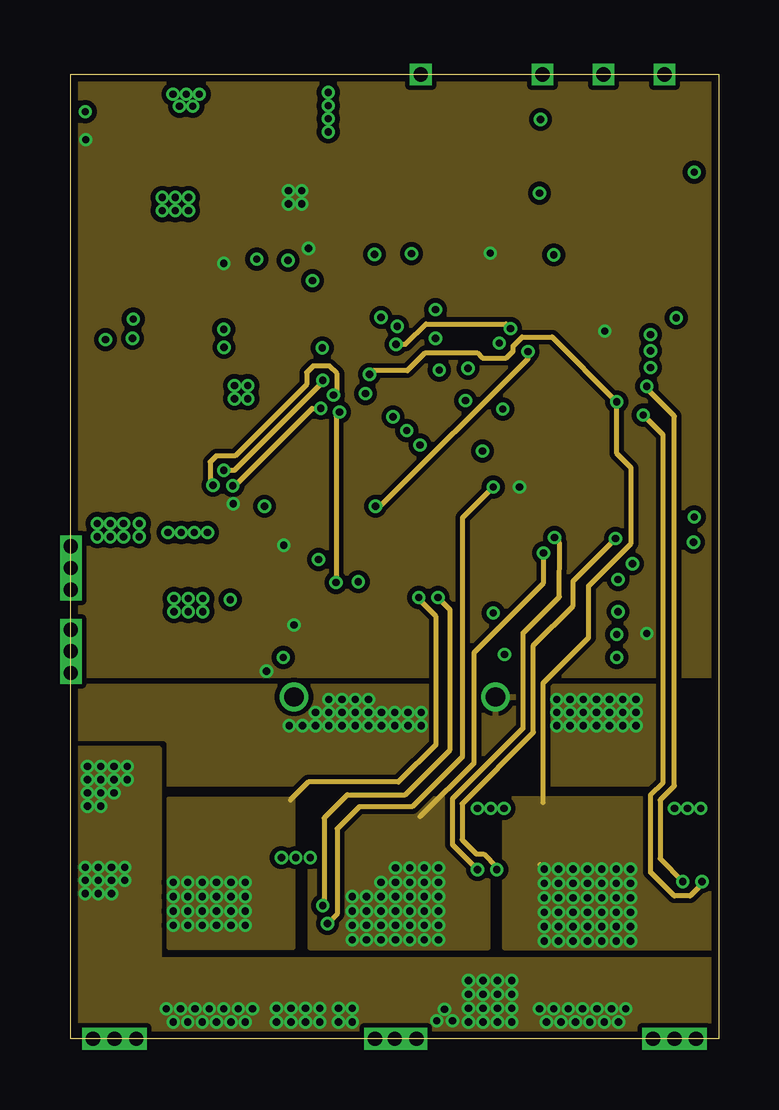
[diagram p4: board, inner layer SUPPLY]
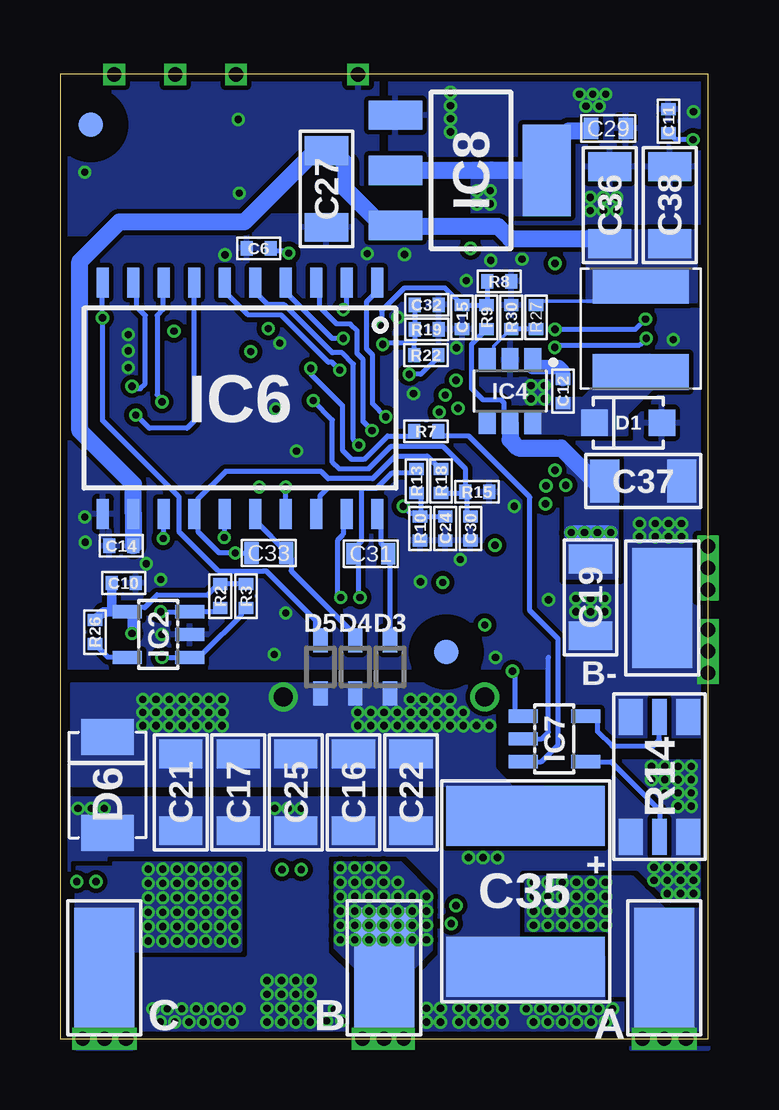
[diagram p5: board, bottom side, seen from below]

Size 27 x 40.2 mm. Coordinates in mm from the lower left corner, seen from the top.
Outline: 0,38.3 0,39.3
Outline: 0,39.3 0,40.2 25.93,40.2 27,40.2 27,38.55 27,0 18.75,0 0,0 0,39.3
Copper layers (1+2*3+16): Top 0.035mm / dielectric 0.012mm / gnd 0.035mm / dielectric 1.5mm / SUPPLY 0.035mm / dielectric 0.012mm / Bottom 0.035mm
Design rules "px_4layer_corrected *": minimum track width 6mil, minimum drill 0.2mm, track to track 0.2mm, track to pad 0.2mm, pad to pad 0.2mm, via to via 0.2mm, smd to smd 0.15mm, copper to edge 0.3mm, drill to drill 0.2mm, minimum pad ring 0.125mm, minimum via ring 0.125mm, stop-mask expansion 1mil, vias tented up to drill 0.31mm, thermal gap 8mil

### Footprints (pad centres in the part's own frame; a part is rotated, then mirrored left to right if it is on the bottom)
5-2,5 = smd 2.5 x 5: 1 0,0
C0402 = smd 0.5 x 0.6: 1 -0.5,0; 2 0.5,0
C0603 = smd 0.6 x 0.9: P$1 -0.725,0; P$2 0.725,0
C1206 = smd 1.2 x 1.8: P$1 -1.6,0; P$2 1.6,0
3024 = smd 2.5 x 6.6: + -3.15,0; - 3.15,0
SM06B = smd 0.6 x 1.55: 1 -2.5,2.275; 2 -1.5,2.275; 3 -0.5,2.275; 4 0.5,2.275; 5 1.5,2.275; 6 2.5,2.275 | smd 1.2 x 1.8: G1 -3.8,-1.55; G2 3.8,-1.55
JST_GH-4P-RA = smd 0.6 x 1.7: 1 1.875,-2.91; 2 0.625,-2.91; 3 -0.625,-2.91; 4 -1.875,-2.91 | smd 1 x 2.8: M$0 -3.825,0.19; M$1 3.825,0.19
SOD123W = smd 1.1 x 1.1: A -1.4,0; C 1.4,0
SOD323 = smd 1 x 0.6: A 1.1,0; C -1.1,0
DO-214AA(SMB) = smd 1.5 x 2.2: A -2,0; C 2,0
FIDUCIA-MOUNT = smd 1.016 x 1.016: P$1 0,0
TQFP64 = smd 1.2 x 0.3: 1 -5.7,3.75; 2 -5.7,3.25; 3 -5.7,2.75; 4 -5.7,2.25; 5 -5.7,1.75; 6 -5.7,1.25; 7 -5.7,0.75; 8 -5.7,0.25; 9 -5.7,-0.25; 10 -5.7,-0.75; 11 -5.7,-1.25; 12 -5.7,-1.75; 13 -5.7,-2.25; 14 -5.7,-2.75; 15 -5.7,-3.25; 16 -5.7,-3.75; 33 5.7,-3.75; 34 5.7,-3.25; 35 5.7,-2.75; 36 5.7,-2.25; 37 5.7,-1.75; 38 5.7,-1.25; 39 5.7,-0.75; 40 5.7,-0.25; 41 5.7,0.25; 42 5.7,0.75; 43 5.7,1.25; 44 5.7,1.75; 45 5.7,2.25; 46 5.7,2.75; 47 5.7,3.25; 48 5.7,3.75 | smd 0.3 x 1.2: 17 -3.75,-5.7; 18 -3.25,-5.7; 19 -2.75,-5.7; 20 -2.25,-5.7; 21 -1.75,-5.7; 22 -1.25,-5.7; 23 -0.75,-5.7; 24 -0.25,-5.7; 25 0.25,-5.7; 26 0.75,-5.7; 27 1.25,-5.7; 28 1.75,-5.7; 29 2.25,-5.7; 30 2.75,-5.7; 31 3.25,-5.7; 32 3.75,-5.7; 49 3.75,5.7; 50 3.25,5.7; 51 2.75,5.7; 52 2.25,5.7; 53 1.75,5.7; 54 1.25,5.7; 55 0.75,5.7; 56 0.25,5.7; 57 -0.25,5.7; 58 -0.75,5.7; 59 -1.25,5.7; 60 -1.75,5.7; 61 -2.25,5.7; 62 -2.75,5.7; 63 -3.25,5.7; 64 -3.75,5.7
SOT23-5L = smd 0.55 x 1.2: 1 -0.95,-1.3; 2 0,-1.3; 3 0.95,-1.3; 4 0.95,1.3; 5 -0.95,1.3
SOIC8 = smd 2.2 x 0.6: 1 -2.6,1.905; 2 -2.6,0.635; 3 -2.6,-0.635; 4 -2.6,-1.905; 5 2.6,-1.905; 6 2.6,-0.635; 7 2.6,0.635; 8 2.6,1.905
SOT23-6 = smd 1 x 0.7: 1 -1.3,0.95; 2 -1.3,0; 3 -1.3,-0.95; 4 1.3,-0.95; 5 1.3,0; 6 1.3,0.95
TSSOP8 = smd 1.2 x 0.35: 1 -2.225,0.975; 2 -2.225,0.325; 3 -2.225,-0.325; 4 -2.225,-0.975; 5 2.225,-0.975; 6 2.225,-0.325; 7 2.225,0.325; 8 2.225,0.975
SOIC20 = smd 1.25 x 0.5: 1 -4.826,5.715; 2 -4.826,4.445; 3 -4.826,3.175; 4 -4.826,1.905; 5 -4.826,0.635; 6 -4.826,-0.635; 7 -4.826,-1.905; 8 -4.826,-3.175; 9 -4.826,-4.445; 10 -4.826,-5.715; 11 4.826,-5.715; 12 4.826,-4.445; 13 4.826,-3.175; 14 4.826,-1.905; 15 4.826,-0.635; 16 4.826,0.635; 17 4.826,1.905; 18 4.826,3.175; 19 4.826,4.445; 20 4.826,5.715
SOT-223 = smd 1.219 x 2.235: 1 -2.3,-3.15; 2 0,-3.15; 3 2.3,-3.15 | smd 3.8 x 2: 4 0,3.15
SRN5040 = smd 1.5 x 4: P$1 -1.8,0; P$2 1.8,0
LITE_ON_RGB_LED = smd 0.65 x 0.85: + -0.425,-0.725; B 0.425,-0.725; G 0.425,0.725; R -0.425,0.725
HOLE_0.6 = drill 0.6 square: P$1 0,0
HOLE_0.8 = drill 0.8: P$1 0,0
PG-TDSON-8 = smd 1.27 x 0.635: 1S -2.54,1.905; 2S -2.54,0.635; 3S -2.54,-0.635; 4G -2.54,-1.905 | smd 1.02 x 0.635: 5D 2.54,-1.905; 6D 2.54,-0.635; 7D 2.54,0.635; 8D 2.54,1.905 | smd 3.678 x 4.445: PAD_D 0.66,-0.003
R0402 = smd 0.5 x 0.6: 1 -0.5,0; 2 0.5,0
R2010-KELVIN = smd 1.5 x 1: 1 -2.5,1.2; 2 2.5,1.2; 11 -2.5,-1.2; 22 2.5,-1.2 | smd 1.5 x 0.6: S1 -2.5,0; S2 2.5,0
PAD.05X.05 = smd 1.27 x 1.27: P$1 0,0
CONNECTION = smd 1 x 1: P$1 -0.5,0; P$2 0.5,0
OSCILLATOR-3.2X2.5-4P = smd 1.3 x 1.1: 1 -1.15,-0.9; 2 1.15,-0.9; 3 1.15,0.9; 4 -1.15,0.9

### Placement (x,y rotation side)
A  1.82,2.95 180 bottom
B  13.5,2.95 0 bottom
B+  1.96,17.95 0 top
B-  1.9,17.95 0 bottom
C  25.15,2.95 0 bottom
C1  24.2,20.65 180 top
C2  25.9,23.15 90 top
C3  22.75,28.68 180 top
C4  22.98,30.43 180 top
C5  20.95,20.1 180 top
C6  18.73,32.95 0 bottom
C7  11.2,32.95 180 top
C8  8.8,19.75 180 top
C9  8.4,21.25 180 top
C10  24.35,19 0 bottom
C11  1.65,38.25 90 bottom
C12  6.05,27 90 bottom
C13  25.16,19.37 180 top
C14  24.45,20.55 180 bottom
C15  10.25,30.08 90 bottom
C16  14.78,10.28 90 bottom
C17  19.57,10.28 90 bottom
C18  9.38,10.28 90 top
C19  4.9,18.4 90 bottom
C20  25.68,10.28 90 top
C21  21.98,10.28 90 bottom
C22  12.38,10.28 90 bottom
C23  4.9,18.4 90 top
C24  10.95,21.28 90 bottom
C25  17.18,10.28 90 bottom
C26  17.5,10.28 90 top
C27  15.9,35.42 270 bottom
C28  15.72,32.9 0 top
C29  4.15,37.95 180 bottom
C30  9.9,21.28 90 bottom
C31  14.05,20.23 180 bottom
C32  11.72,30.6 180 bottom
C33  18.3,20.25 180 bottom
C34  25.2,28.3 270 top
C35  7.6,6.15 270 bottom
C36  4.1,34.75 90 bottom
C37  2.7,23.25 0 bottom
C38  1.6,34.75 90 bottom
CON1  2.86,30.1 270 top
CON2  22.2,38.15 0 top
CON3  13.3,38.15 0 top
D1  3.32,25.68 180 bottom
D3  13.25,15.5 270 bottom
D4  14.7,15.5 270 bottom
D5  16.15,15.5 270 bottom
D6  25.02,10.58 90 bottom
FD1  12.6,39.38 0 top
FD2  25.77,2.05 0 top
FD3  25.73,38.1 0 bottom
FD4  10.9,16.12 0 bottom
IC1  14.95,25.85 180 top
IC2  22.9,16.85 90 bottom
IC3  4.75,37.39 0 top
IC4  8.25,27 270 bottom
IC5  22.9,17.05 0 top
IC6  19.5,26.7 270 bottom
IC7  6.4,12.5 270 bottom
IC8  9.88,36.2 270 bottom
L1  2.8,29.6 90 bottom
LED1  1.32,23.9 0 top
PAD1  0,20.53 0 top
PAD2  0,19.62 0 top
PAD3  0,18.73 0 top
PAD4  0,15.25 0 top
PAD5  0,16.15 0 top
PAD6  0,17.05 0 top
PAD7  1.82,0 0 bottom
PAD8  0.93,0 0 bottom
PAD9  12.68,0 0 bottom
PAD10  13.5,0 0 bottom
PAD11  25.15,0 0 bottom
PAD12  26.05,0 0 bottom
PAD13  14.58,40.2 90 top
PAD14  19.66,40.2 90 top
PAD15  22.2,40.2 90 top
PAD16  24.74,40.2 90 top
PAD17  2.72,0 0 bottom
PAD18  14.4,0 0 bottom
PAD19  24.25,0 0 bottom
PAD21  17.7,14.25 90 top
PAD22  9.3,14.25 90 top
Q1  5.47,11.8 90 top
Q2  5.47,4.9 90 top
Q3  13.5,11.8 90 top
Q4  13.5,4.9 90 top
Q5  21.52,11.8 90 top
Q6  21.52,4.9 90 top
R2  20.32,18.45 270 bottom
R3  19.25,18.45 270 bottom
R4  16.7,18 90 top
R5  7.72,30.65 0 top
R6  7.72,31.73 0 top
R7  11.75,25.33 180 bottom
R8  8.7,31.58 0 bottom
R9  9.22,30.08 270 bottom
R10  12,21.28 90 bottom
R11  9.15,5.85 0 top
R12  9.15,4.65 0 top
R13  12.15,23.25 270 bottom
R14  2.03,10.93 90 bottom
R15  9.62,22.8 180 bottom
R16  17.2,6 0 top
R17  17.2,4.8 0 top
R18  11.12,23.25 270 bottom
R19  11.72,29.58 180 bottom
R20  25.2,5.8 0 top
R21  25.2,4.6 0 top
R22  11.75,28.5 180 bottom
R23  3.38,22.83 0 top
R24  3.38,23.88 0 top
R25  3.38,24.93 0 top
R26  25.55,16.95 270 bottom
R27  7.17,30.08 90 bottom
R30  8.2,30.08 270 bottom
TP1  13.05,17.3 0 top
TP2  14.85,17.3 0 top
TP3  7.42,17.25 0 top
TP4  9.3,17.25 0 top
TP5  11.1,17.25 0 top
U$2  25.75,33.25 270 top
X1  23.38,23.5 270 top

### Tracks (layer width: path | path; a pad name or v marks a point on that pad's centre or on a via)
BLABLA
  Bottom 0.2: IC7.3 6.95,11.55 6.25,12.25 6.25,16.68 7.42,17.85 7.42,22.58 9.97,25.12 11.05,25.12 R7.1
BOOT0
  Top 0.2: IC1.60 R4.2
CAN1_RX
  Top 0.2: IC1.44 8.57,24.1 8.53,24.1 5.83,26.8 4.28,26.8 3.96,27.12 3.96,30.71 3.62,31.03 3.62,33.82 3.15,34.3 3.15,35.38 3.04,35.48 IC3.4
CAN1_TX
  Top 0.2: IC3.1 2.28,39.17 3.51,39.17 3.68,39 3.68,36.4 3.38,36.1 0.94,36.1 0.69,35.84 0.69,35.03 0.88,34.83 2.38,34.83 2.75,34.45 2.75,34.13 3.22,33.65 3.22,30.87 3.55,30.54 3.55,26.95 4.1,26.4 5.64,26.4 8.44,23.6 | 8.44,23.6 8.65,23.6 | 8.65,23.6 IC1.45 | 8.44,23.6 8.65,23.6
CURRENT_SHUNT  (via drill 0.3)
  other vias: 3.97,1.25 4.57,1.25 5.18,1.25 5.78,1.25 6.38,1.25 6.97,1.25 7.58,1.25 4.28,0.7 4.88,0.7 5.47,0.7 6.08,0.7 6.67,0.7 7.28,0.7 11.72,1.28 11.72,0.7 10.38,1.28 10.38,0.7 11.15,1.28 11.15,0.7 19.52,1.25 20.12,1.25 20.73,1.25 21.32,1.25 21.93,1.25 22.52,1.25 23.12,1.25 19.82,0.7 20.43,0.7 21.02,0.7 21.62,0.7 22.23,0.7 22.82,0.7 15.57,1.23 15.9,0.75 15.25,0.75 26.25,9.6 16.95,9.6 9.78,1.28 9.78,0.7 8.57,1.28 8.57,0.7 9.18,1.28 9.18,0.7 18.38,1.28 18.38,0.7 18.38,1.85 18.38,2.43 17.77,1.28 17.77,0.7 17.77,1.85 17.77,2.43 16.57,1.28 16.57,0.7 16.57,1.85 16.57,2.43 17.18,1.28 17.18,0.7 17.18,1.85 17.18,2.43 25.7,9.6 25.15,9.6 17.5,9.6 18.05,9.6 0.6,7.15 1.15,7.15 1.7,7.15 2.25,7.15 0.6,6.6 1.15,6.6 1.7,6.6 2.25,6.6 0.6,6.05 1.15,6.05 1.7,6.05 8.78,7.55 9.38,7.55 9.97,7.55 0.7,10.8 1.25,10.8 1.8,10.8 1.8,11.35 1.25,11.35 0.7,11.35 0.7,10.25 1.25,10.25 1.8,10.25 2.35,10.8 2.35,11.35 0.7,9.7 1.25,9.7
  pour Top (rank 3, no thermals): 0,0 -0.01,11.53 2.6,11.53 2.6,3 27,3 27,0
  pour Bottom (rank 3, no thermals): 0.32,0 0.31,11.55 3.93,11.55 3.93,7.89 11.35,7.85 11.35,10 26.95,10 26.95,0
  pour Top (no thermals): 26.45,8.2 26.45,9.8 24.9,9.8 24.9,8.2
  pour Top (no thermals): 16.75,8.15 16.75,9.85 18.3,9.85 18.3,8.15
  pour SUPPLY: 0,0 27,0 27,3.3 3.7,3.3 3.7,12.1 0,12.1
  pour Top (no thermals): 8.57,8.6 8.57,7.35 10.18,7.35 10.18,8.6
FET_A_H  (via drill 0.3)
  Top 0.2: IC1.41 10.1,25.6 10.3,25.4 12.9,25.4 v13.43,25.93
  Bottom 0.2: v13.43,25.93 13.97,26.48 13.97,28.5 14.22,28.75 14.22,30.73 13.79,31.16 IC6.1
FET_A_HO  (via drill 0.3)
  Top 0.2: R11.2 9.85,5.65 10.4,5.65 v10.5,5.55
  SUPPLY 0.2: v15.3,18.4 15.3,18.38 15.8,17.88 15.8,12.05 13.93,10.18 11.53,10.18 10.55,9.2 10.55,5.6 v10.5,5.55
  Bottom 0.2: v15.3,18.4 15.43,18.53 15.43,20.8 15.21,21.02 15.21,21.72 IC6.19
FET_A_L  (via drill 0.3)
  Top 0.2: IC1.23 15.7,30.65 15.45,30.4 v15.2,30.4
  Bottom 0.2: v15.2,30.4 15.05,30.55 IC6.2
FET_A_LO  (via drill 0.3)
  Top 0.2: v10.7,4.8 9.8,4.8 R12.2
  SUPPLY 0.2: v17.6,23 16.32,21.73 16.32,11.78 14.22,9.68 12.03,9.68 11.1,8.75 11.1,5.2 v10.7,4.8
  Bottom 0.2: IC6.17 v17.59,23 v17.6,23
FET_A_VB
  Bottom 0.2: IC6.20 13.63,21.72 13.63,20.66 13.32,20.35 C31.P$1 13.25,20.15 D3.C
FET_A_VS  (via drill 0.3)
  SUPPLY 0.2: v14.5,18.4 14.5,18.33 15.22,17.6 15.22,12.28 13.65,10.7 9.9,10.7 9.15,9.95
  Bottom 0.2: 14.45,22.95 15.85,22.95 16.18,22.62 16.18,22.02 IC6.18 | v14.5,18.4 14.57,18.48 14.57,20.23 C31.P$2 14.78,20.4 14.43,20.75 14.43,22.93 14.45,22.95 | 14.45,22.95 13.8,22.95 13.15,23.6 12.3,23.6 R13.1 | A.1 PAD7.P$1
  other vias: 4.28,6.53 4.88,6.53 5.47,6.53 6.08,6.53 6.67,6.53 7.28,6.53 4.28,5.93 4.88,5.93 6.08,5.93 5.47,5.93 6.67,5.93 7.28,5.93 4.28,5.33 4.88,5.33 5.47,5.33 6.08,5.33 6.67,5.33 7.28,5.33 4.28,4.73 4.88,4.73 5.47,4.73 6.08,4.73 6.67,4.73 7.28,4.73
  pour Top (no thermals): 3.35,9.8 7.7,9.8 7.7,3.53 3.35,3.53
  pour Bottom (no thermals): 0,-0.4 0,5.35 1.82,5.35 3.18,6.7 7.55,6.7 7.55,3.75 4,3.75 4,1.85 3.2,1.85 3.2,-0.4
  pour SUPPLY: 4.1,10 9.25,10 9.25,3.8 4.1,3.8
FET_B_H  (via drill 0.3)
  Top 0.2: IC1.42 10,25.1 10.1,25 13.65,25 v14,25.35
  Bottom 0.2: v14,25.35 14.38,25.73 14.38,28.31 14.62,28.56 14.62,29.53 14.9,29.8 15.47,29.8 16.18,30.5 16.18,31.38 IC6.3
FET_B_HO  (via drill 0.3)
  Top 0.2: R16.2 17.7,6.15 16.95,6.9 v16.95,7.05
  SUPPLY 0.2: v16.95,7.05 15.9,8.1 15.9,10 18.85,12.95 18.85,16.92 20.36,18.42 20.36,20.66 20.15,20.88 v20.15,20.9
  Bottom 0.2: IC6.15 20.15,21.86 v20.15,20.9
FET_B_L  (via drill 0.3)
  Top 0.2: IC1.26 14.2,30.58 15.2,29.58 v15.2,29.2
  Bottom 0.2: v15.2,29.2 15.68,29.2 17.51,31.04 17.59,31.12 IC6.4
FET_B_LO  (via drill 0.3)
  Top 0.2: R17.2 18.25,5.35 18.25,6.55 v17.75,7.05
  SUPPLY 0.2: v17.75,7.05 17.75,7.15 17.2,7.7 16.9,7.7 16.3,8.3 16.3,9.8 19.27,12.78 19.27,16.4 20.93,18.05 20.93,19.08 v22.7,20.85
  Bottom 0.2: IC6.13 22.7,21.85 v22.7,20.85
FET_B_VB
  Bottom 0.2: IC6.16 18.87,21.55 18.82,21.55 17.57,20.3 C33.P$1 17.38,20.05 17.38,19.5 16.35,18.48 14.7,16.83 D4.C
FET_B_VS  (via drill 0.3)
  Top 0.2: Q4.6D 14.12,7.43 v14.12,7.13
  SUPPLY 0.2: 14.56,9.26 16.8,11.5 16.8,16.1 19.7,19 v19.7,20.25 | 15.35,7.15 v15.32,7.13
  Bottom 0.2: C33.P$2 v19.7,20.25 20.38,20.25 21.25,21.12 21.25,21.72 IC6.14 21.25,22.03 21.25,22.5 20.1,23.65 16.12,23.65 15.82,23.35 13.97,23.35 13.03,24.3 11.7,24.3 11.15,23.75 R18.1 | B.1 PAD10.P$1
  other vias: 13.53,7.13 14.72,7.13 12.93,6.53 13.53,6.53 14.12,6.53 14.72,6.53 15.32,6.53 11.72,5.93 12.32,5.93 12.93,5.93 14.12,5.93 13.53,5.93 14.72,5.93 15.32,5.93 11.72,5.33 15.32,5.33 11.72,4.73 15.32,4.73 11.72,4.13 15.32,4.13 12.32,5.33 12.93,5.33 13.53,5.33 14.12,5.33 14.72,5.33 14.72,4.73 14.12,4.73 13.53,4.73 12.93,4.73 12.32,4.73 12.32,4.13 12.93,4.13 13.53,4.13 14.12,4.13 14.72,4.13
  pour Top (no thermals): 10.93,9.8 15.72,9.8 15.72,3.45 10.93,3.45
  pour SUPPLY: 9.95,3.8 17.4,3.8 17.4,10 9.95,10
  pour Bottom (no thermals): 12.32,-0.32 14.68,-0.32 14.68,2.95 15.53,3.8 15.53,7.33 12.8,7.33 11.53,6.05 11.53,3.7 12.32,2.9
FET_C_H  (via drill 0.3)
  Top 0.2: IC1.43 14.4,24.6 v14.55,24.75
  Bottom 0.2: v14.55,24.75 14.78,24.98 14.78,28.12 15.25,28.6 15.65,28.6 17.65,30.6 18.35,30.6 18.87,31.12 IC6.5
FET_C_HO  (via drill 0.3)
  Top 0.2: R20.2 25.55,5.95 25.55,6.5 v25.5,6.55
  SUPPLY 0.2: v25.5,6.55 24.55,7.5 24.55,9.95 25.15,10.55 25.15,25.95 24,27.1 v24,27.2
  Bottom 0.2: v24,27.2 23.9,27.1 23.65,27.1 23.45,27.3 23.45,30.15 23.8,30.51 23.8,31.38 IC6.9
FET_C_L  (via drill 0.3)
  Top 0.2: v15.35,27.88 15.35,27.9 14.62,28.62 14.62,29.51 13.7,30.43 IC1.27
  Bottom 0.2: IC6.6 20.14,31.53 20.14,31.15 19.2,30.2 19.17,30.18 17.79,30.18 15.82,28.2 15.68,28.2 v15.35,27.88
FET_C_LO  (via drill 0.3)
  Top 0.2: R21.2 26.35,5.25 26.35,6.5 v26.3,6.55
  SUPPLY 0.2: v26.3,6.55 26.3,6.45 25.8,5.95 25.15,5.95 24.15,6.95 24.15,10.15 24.68,10.68 24.68,25.18 v23.85,26
  Bottom 0.2: v23.85,26 23.82,26 23.27,25.45 21.7,25.45 21.42,25.73 21.42,31.51 IC6.7
FET_C_VB  (via drill 0.3)
  Top 0.2: C34.P$1 25.2,30.02 v25.23,30.05
  Bottom 0.2: 18.52,19.5 20.4,19.5 22.05,21.15 22.05,22.6 25.23,25.78 v25.23,30.05 25.23,31.51 IC6.10 | 18.52,19.5 18.41,19.5 | D5.C 16.35,16.8 16.35,17.44 18.41,19.5 | 18.41,19.5 18.52,19.5
FET_C_VS  (via drill 0.3)
  Top 0.2: Q6.8D 19.73,7.34 v19.73,7.08 | C34.P$2 24.88,27.58 24.85,27.55 24.85,27.03 24.43,26.6 22.8,26.6 v22.75,26.55
  SUPPLY 0.2: v19.73,7.08 19.55,7.25 | 19.68,9.85 19.68,14.83 21.57,16.73 21.57,18.88 23.35,20.65 23.35,23.8 22.75,24.4 v22.75,26.55 20.05,29.25 18.8,29.25 18.43,28.88 18.43,28.66 18.14,28.38 17.15,28.38 16.93,28.6 14.78,28.6 14.03,27.85 12.6,27.85 v12.45,27.7
  Bottom 0.2: v22.75,26.55 22.75,26.65 22.95,26.85 22.95,30.15 22.69,30.41 22.69,31.51 IC6.8 | R22.1 11.25,28.43 11.97,27.7 v12.45,27.7 | C.1 PAD11.P$1
  other vias: 20.32,7.08 20.93,7.08 21.52,7.08 22.12,7.08 22.73,7.08 23.32,7.08 19.73,6.48 20.32,6.48 20.93,6.48 21.52,6.48 22.12,6.48 22.73,6.48 23.32,6.48 19.73,5.88 20.32,5.88 20.93,5.88 22.12,5.88 21.52,5.88 22.73,5.88 23.32,5.88 19.73,5.28 20.32,5.28 20.93,5.28 21.52,5.28 22.12,5.28 22.73,5.28 23.32,5.28 19.73,4.68 20.32,4.68 20.93,4.68 21.52,4.68 22.12,4.68 22.73,4.68 23.32,4.68 19.73,4.08 20.32,4.08 20.93,4.08 22.12,4.08 21.52,4.08 22.73,4.08 23.32,4.08
  pour Top (no thermals): 23.75,3.5 19.3,3.5 19.3,9.8 23.75,9.8
  pour Bottom (no thermals): 19.5,3.7 19.5,7.3 24.75,7.3 24.75,7.1 26.3,7.1 26.3,-0.4 24,-0.4 24,3.7
  pour SUPPLY: 18.05,3.8 27,3.8 27,10 18.05,10
GND  (via drill 0.3, 0.3 pad 0.55)
  Top 0.2: IC1.10 IC1.11 IC1.12
  Bottom 0.2: IC7.2 6.92,12.5 6.65,12.78 6.65,15.9
  other vias: 8.07,22.2 24.15,28.68 17.6,17.75 1.1,20.93 1.1,21.48 1.65,20.93 1.65,21.48 2.2,20.93 2.2,21.48 2.85,20.93 2.85,21.48 17.85,29 22.75,16.85 18.07,16.03 22.8,19.15 23.4,19.8 24.15,27.98 24.15,29.35 17.15,24.5 18,26.25 10.32,19.98 4.9,17.8 4.3,17.8 5.5,17.8 4.9,18.35 4.3,18.35 5.5,18.35 8.85,15.9 6.65,18.3 0.61,38.65 7.38,27.23 6.83,26.68 6.83,27.23 7.38,26.68 10.47,28.8 9.05,32.45 10.07,31.6 7.75,32.5 12.28,26.9 1.45,29.15 11.97,19.05 12.65,32.7 12.93,30.08 14.2,32.73 20.12,32.67 3.8,35.08 4.36,35.08 4.9,35.08 4.9,34.53 4.36,34.53 3.8,34.53 4.26,39.38 4.8,39.38 5.36,39.38 5.08,38.88 4.53,38.88 25.98,21.75 25.95,20.7 10.72,39.45 10.72,38.9 10.72,38.35 10.72,37.8
  pour gnd: 0,0 0,40 13.35,40 13.35,33.4 27,33.4 27,0
  pour Bottom (rank 3, no thermals): 0,12.65 0,24.65 6.25,24.65 6.25,12.65
  pour Top (rank 3): 0,15.3 0,40.1 9,40.1 9,33.4 27,33.4 27,15.3
  pour Bottom (rank 3): 0,15.5 0,40 13.25,40 13.25,34.3 26.98,34.3 26.98,15.5
  pour Top (no thermals): 5.7,16.55 4.1,16.55 4.1,18.55 5.7,18.55
GNDD  (via drill 0.3 pad 0.55)
  Top 0.2: CON2.4 20.21,35.35
  Top 0.7: CON3.M$0 9.47,37.29 10.03,37.29 10.37,36.95 11.45,36.95 | 14.18,37.55 13.36,37.55 12.76,36.95 11.45,36.95 | 11.45,36.95 11.43,36.92 CON3.4
  other vias: 19.52,35.25 19.57,38.33 25.98,36.12
  pour Top: 13.8,40 27,40 27,33.55 13.8,33.55
  pour gnd: 13.8,40 27,40 27,33.83 13.8,33.83
  pour Bottom (rank 4): 27,40 13.8,40 13.8,33.55 27,33.55
I2C_SCL  (via drill 0.3)
  Top 0.2: IC1.61 17.2,19.15 18.98,17.38 IC5.2 21.62,17.38 22.05,16.95 22.05,16.6 v22.75,15.9
  Bottom 0.2: v22.75,15.9 IC2.1 21.43,16.08 21.02,16.08 19.45,17.65 19.45,17.75 R3.2
I2C_SDA  (via drill 0.3)
  Top 0.2: IC1.62 17.7,19.35 19.02,18.03 IC5.1 22.57,18.03 v22.8,17.8
  Bottom 0.2: v22.8,17.8 IC2.3 20.48,17.8 R2.2
N$1
  Top 0.2: R5.1 6.26,31.6 CON1.2
N$2
  Top 0.2: CON1.3 4.62,30.6 4.03,31.2 4.03,33.1 4.18,33.25 6.28,33.25 7.08,32.45 7.08,31.88 R6.1
N$3  (via drill 0.3 pad 0.55)
  Top 0.2: R25.2 3.88,24.73 5.14,24.73 6.16,23.7 v6.38,23.7 | v10.5,27.45 10.35,27.6 IC1.37
  SUPPLY 0.2: v10.5,27.45 10.5,27.38 6.82,23.69 v6.38,23.69 v6.38,23.7
N$4
  Top 0.2: Q2.4G 7.38,2.68 8.5,3.8 8.5,4.5 R12.1
N$5
  Top 0.2: Q3.4G 15.4,8.74 15.83,8.74 16.2,8.37 16.2,6.6 16.7,6.1 R16.1
N$6
  Top 0.2: R23.1 2.88,22.85 2.85,22.88 1.85,22.88 1.75,22.98 LED1.B
N$7
  Top 0.2: LED1.R 1.12,24.85 1.12,25.2 1.28,25.35 2.45,25.35 R25.1
N$8
  Top 0.2: Q4.4G 15.4,2.66 16.55,3.8 16.55,4.65 R17.1
N$10
  Bottom 0.2: IC2.5 25,15.9 R26.2
N$11
  Top 0.2: Q5.4G 23.43,8.74 23.91,8.74 24.2,8.44 24.2,6.3 R20.1
N$12  (via drill 0.3 pad 0.55)
  Top 0.2: R24.2 3.88,23.7 3.9,23.68 5.32,23.68 v5.92,23.08 | IC1.38 10.04,27.1 10.26,26.88 10.9,26.88 v10.94,26.83
  SUPPLY 0.2: v5.92,23.08 5.8,23.2 5.8,24.05 6.05,24.3 6.85,24.3 9.82,27.28 9.82,27.78 10.1,28.05 10.78,28.05 11.1,27.73 11.1,26.99 v10.94,26.83
N$13
  Bottom 0.2: IC7.5 4.78,13.45 4.6,13.28 4.6,12.8 4,12.2 2.28,12.2 2.03,12.45 R14.S2
N$14
  Top 0.2: Q1.4G 7.38,8.74 7.93,8.74 8.15,8.52 8.15,6.35 R11.1
N$16
  Top 0.2: IC1.5 21.38,24.1 22.18,23.3 23.2,23.3 23.6,22.9 24.12,22.9 24.27,22.75 X1.3 23.83,21.9 23.83,20.66 23.83,20.65 C1.2
N$17
  Top 0.2: Q6.4G 23.43,2.63 24.55,3.75 24.55,4.45 R21.1
N$18  (via drill 0.3 pad 0.55)
  Top 0.2: R23.2 3.9,22.8 5.32,22.8 5.62,22.5 6.16,22.5 6.71,23.05 v6.75,23.05 | IC1.39 9.95,26.6 10.27,26.28 v10.41,26.28
  SUPPLY 0.2: v6.75,23.05 6.83,23.05 10.05,26.28 v10.41,26.28
N$19
  pour Bottom (no thermals): 7.55,25.23 3.4,25.23 3.4,26.08 2.4,27.08 2.4,28.45 4.7,28.45 4.7,27.15 5.2,26.65 6.25,26.65 6.25,26.1 7.55,26.1
N$20
  Bottom 0.2: IC7.4 4.03,11.55 2.01,9.53 2.01,8.17 2.05,8.13 2.03,8.15 R14.S1
N$21
  Top 0.2: IC1.6 22.43,24.6 X1.1 22.48,24.5 22.88,24.1 23.11,24.1 23.56,23.65 C2.2
N$22
  Top 0.6: CON3.1 17.65,35.25 19.43,33.48 23.62,33.48 24.07,33.92 CON2.1 24.07,38.38 24.74,39.04 PAD16.P$1
N$23
  Top 0.2: IC3.7 7.35,37.83 6.12,37.83 5.92,37.62 5.92,36.72 5.53,36.32 5.53,34.78 5.98,34.33 8.03,34.33 8.68,33.67 12.9,33.67 13.93,34.7 CON3.2 13.93,35.95 14.47,36.5 15.53,36.5 15.93,36.1 19.42,36.1 19.82,36.51 20.59,36.51 20.95,36.15 20.95,34.4 21.27,34.08 22.55,34.08 22.77,34.3 22.77,35.19 CON2.2 22.82,39.58 PAD15.P$1
N$24
  Bottom 0.152: IC4.3 8.93,28.58 8.93,28.88 8.22,29.58 R30.2
  Bottom 0.2: R27.1 R30.2
N$25
  Top 0.2: CON2.3 21.57,35.35 21.45,35.48 21.45,36.26 20.8,36.91 | IC3.6 7.43,36.68 6.45,36.68 5.92,36.15 5.92,34.95 6.12,34.75 8.2,34.75 8.88,34.08 9.88,34.08 12.12,34.08 12.68,34.62 CON3.3 12.68,35.75 13.82,36.9 15.7,36.9 16.1,36.5 19.25,36.5 19.66,36.91 20.8,36.91 | 20.8,36.91 20.8,39.06 PAD14.P$1
N$26
  Top 0.2: LED1.G 1.75,24.3 2.45,24.3 R24.1
N$27
  Top 0.2: IC1.53 13.2,18.85 14.75,17.3 TP2.P$1
N$28  (via drill 0.3)
  Top 0.2: IC1.36 10.1,28.1 10.2,28.2 10.57,28.2 11.53,27.25 11.53,26.45 v11.2,26.12 | TP5.P$1 11.05,17.3 v11.05,19.03
  SUPPLY 0.2: v11.2,26.12 11.05,25.98 v11.05,19.03
N$29
  Top 0.2: IC1.52 12.7,18.95 12.7,18.76 13.05,18.41 TP1.P$1
N$31
  Bottom 0.6: IC4.1 7.3,28 6.6,28 6.22,28 6.05,27.83 C12.2
SENSE_A  (via drill 0.3)
  Top 0.2: IC1.15 19.8,29.1 19.35,28.65 v19.05,28.65
  SUPPLY 0.2: v12.7,22.2 12.9,22.2 19.05,28.35 v19.05,28.65
  Bottom 0.2: C24.2 R10.2 11.95,21.78 11.95,22.23 | R13.2 11.95,22.75 11.95,22.23 | v12.7,22.2 12.43,21.93 11.95,21.93 11.95,22.23
SENSE_B  (via drill 0.3)
  Top 0.2: IC1.16 19.15,29.6 18.45,28.9 18.45,28.35 16.7,26.6 v16.45,26.6
  Bottom 0.2: v16.45,26.6 15.65,25.8 15.65,24.03 15.38,23.75 14.15,23.75 13.2,24.7 11.05,24.7 10.12,23.78 R15.2 | R18.2 10.18,22.75 R15.2 | C30.2 10.03,21.9 10.03,22.7 R15.2
SENSE_C  (via drill 0.3)
  Top 0.2: IC1.17 18.7,29.98 v18.32,29.6
  SUPPLY 0.2: v13.55,28.95 13.95,28.95 14.8,29.8 18.12,29.8 v18.32,29.6
  Bottom 0.2: C32.2 R19.2 12.22,29.08 12.25,29.05 12.25,29.03 | v13.55,28.95 13.47,29.03 12.25,29.03 | R22.2 12.25,29.03
SENSE_CURRENT  (via drill 0.3)
  Top 0.2: v16.55,27.95 16.55,30.55 16.7,30.7 IC1.21 16.68,31.58 16.68,32.67 C28.P$2
  Bottom 0.2: v16.55,27.95 16.55,27.7 15.22,26.38 15.22,24.53 14.85,24.15 14.32,24.15 13.35,25.12 12.45,25.12 R7.2
SENSE_VIN  (via drill 0.3)
  Top 0.2: v13.6,29.7 13.7,29.7 14.2,29.2 14.2,28 14.95,27.25 16.7,27.25 17.2,27.75 IC1.20
  Bottom 0.2: R8.1 9.2,30.6 R9.1 C15.2 10.25,30.6 10.95,31.3 12.65,31.3 13.6,30.35 v13.6,29.7
SWCLK  (via drill 0.3 pad 0.55)
  Top 0.2: IC1.49 11.2,19.68 10.88,19.68 10.18,18.98 7.67,18.98 7.35,19.3 7.35,23.55 5.3,25.6 3.77,25.6 2.75,26.62 2.75,29.03 v2.57,29.2 | CON1.5 5.34,28.8 6.36,28.8 v6.38,28.83
  Bottom 0.2: v2.57,29.2 2.85,28.93 6.29,28.93 v6.38,28.83
SWDIO  (via drill 0.3 pad 0.55)
  Top 0.2: IC1.46 8.38,23.1 5.47,26 3.93,26 3.15,26.78 3.15,29.53 2.68,30 v2.6,30 | v6.38,29.58 6.3,29.65 5.19,29.65 CON1.4
  Bottom 0.2: v6.38,29.58 3.03,29.58 v2.6,30
TSENS_OS
  Top 0.2: IC5.3 16.38,16.73 16.02,17.08 16.02,18.58 15.53,19.08 14.93,19.08 14.7,19.3 IC1.56
USART1_RX/PWM
  Top 0.2: IC1.59 16.2,26 16.23,26.03 | IC1.14 19.9,28.6 19.35,28.05 18.75,28.05 16.73,26.03 16.23,26.03 | R6.2 8.22,31.7 8.4,31.53 9.38,30.55 11.03,30.55 15.55,26.03 16.23,26.03
USART1_TX
  Top 0.2: R5.2 8.22,30.5 8.28,30.45 8.82,30.45 9.12,30.15 10.85,30.15 15.7,25.3 IC1.58
VBAT  (via drill 0.3)
  Top 0.2: PAD1.P$1 PAD2.P$1
  Bottom 0.2: IC4.5 8.5,25.95 8.5,26.5 8.62,26.62 9.38,26.62 9.85,27.1 9.85,28.95 R9.2
  Bottom 0.6: v4.6,21.1 v5.7,21.1 v4.05,21.1 v4.6,21.1 | v4.6,21.1 v5.15,21.1
  Bottom 0.7: IC4.5 8.25,24.98 7.9,24.62 6.12,24.62 4.75,23.25 C37.P$1
  other vias: 11.3,13.05 11.85,13.05 12.4,13.05 12.95,13.05 13.5,13.05 14.05,13.05 14.6,13.05 11.3,14.15 11.85,14.15 12.4,14.15 11.3,13.6 11.85,13.6 12.4,13.6 12.95,13.6 13.5,13.6 14.05,13.6 14.6,13.6 20.25,13.05 20.8,13.05 21.35,13.05 21.9,13.05 22.45,13.05 23,13.05 23.55,13.05 20.25,14.15 20.8,14.15 21.35,14.15 21.9,14.15 22.45,14.15 23,14.15 23.55,14.15 20.25,13.6 20.8,13.6 21.35,13.6 21.9,13.6 22.45,13.6 23,13.6 23.55,13.6 9.1,13.05 9.65,13.05 10.2,13.05 10.75,13.05 10.75,14.15 10.2,13.6 10.75,13.6
  pour Top (rank 2, no thermals): 27,14.75 5.95,14.75 5.95,21.3 3.75,21.3 3.75,20.35 0,20.35 0,12 3.25,12 3.25,10.65 27,10.65
  pour Bottom (no thermals): 26.5,10.6 10.8,10.6 10.8,8.3 6.85,8.3 6.85,10.45 8.17,10.45 8.93,11.25 8.93,14.75 26.5,14.75
  pour Bottom (no thermals): 5.9,19.25 3.8,19.25 3.8,24.05 5.9,24.05
  pour SUPPLY (rank 2): 0,14.7 27,14.7 27,10.6 0,10.6
VDD_3V3  (via drill 0.3, 0.3 pad 0.55)
  Top 0.2: IC1.48 8.9,22.1 C9.1 8.88,21.23 v8.88,20.58 8.88,20.55 9.53,19.9 C8.P$1 | IC1.64 18.7,22.1 | 18.7,22.1 v18.7,23 | IC1.13 21.6,28.1 | 21.6,28.1 21.7,28.1 22.25,28.65 C3.2 v22.25,29.5 C4.P$2 | IC1.19 17.7,32.53 v17.48,32.75 | 18.7,22.1 IC1.1 20.8,22.1 20.8,20.45 C5.2 | CON1.1 6.1,32.6 v6.38,32.33 | v9.9,32.95 C7.2 10.82,32.83 10.82,32.73 11.2,32.35 IC1.32 | LED1.+ 1.12,22.95 1.12,22.63 1.65,22.1 6.58,22.1 v6.78,22.3 | IC3.3 1.35,36.76 v0.62,37.48 | 20.7,26.15 IC1.9 21.42,26.1 21.6,26.28 21.6,28.1
  Top 0.3: C13.1 25.56,19.27 25.56,18.03 IC5.8 24.43,18.03 24,17.6 v24,16.9
  Bottom 0.2: v17.48,32.75 17.55,32.83 18.23,32.83 C6.2 | R3.1 R2.1 20.4,18.95 20.85,18.5 22.95,18.5 23.48,17.98 24.02,17.98 IC2.4 | IC7.1 8.05,13.45 8.05,15.23 v8.15,15.33 | v0.62,37.48 1.35,37.48 1.62,37.75 C11.1
  Bottom 0.4: 24.85,17.8 IC2.4 24,17.8 v24,16.9 | 24.85,17.8 C10.1 | R26.1 25.2,17.8 24.85,17.8
  Bottom 0.7: IC8.2 8.95,36.2 | 8.95,36.2 IC8.4 6.72,36.92 5.8,37.85 4.97,37.85 C29.P$2 | 8.95,36.2 9.1,36.2
  other vias: 9.3,17.25 9.07,35.35 9.62,35.35 9.62,34.8 9.07,34.8
  pour Bottom (no thermals): 7.5,36.45 9.8,36.45 9.8,34.4 7.5,34.4
  pour SUPPLY: 0,15.15 27,15.15 27,40.2 0,40.2
VDD_10V5
  Bottom 0.152: R27.2 7,30.75 2.8,30.75 L1.P$2
  Bottom 0.7: C36.P$1 4.3,33.35 8.25,33.35 8.75,33.86 12.98,33.86 IC8.3 13.57,33.9 15.07,35.4 15.07,36.45 15.65,37.03 C27.P$1 16.35,37.03 19.32,34.05 24.52,34.05 26.18,32.4 26.18,25.35 23.95,23.12 IC6.12 C14.1
  pour Bottom (no thermals): 0.5,33.67 5.03,33.67 5.03,30.73 0.5,30.73